# EAGLE schematic minion1 (EAGLE 7.7.0)
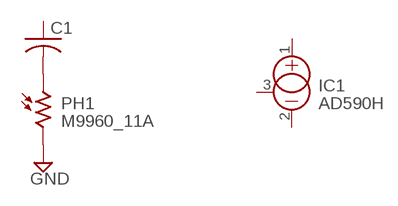
[diagram p0: schematic, sheet 1]

## Parts
C1  C-US025-024X044  [C025-024X044]
IC1  AD590H  [TO18]
PH1  M9960_11A  [M9960]

## Nets
GND: PH1.2
N$1: C1.2 PH1.1
Unconnected: C1.1 IC1.1(+) IC1.2(-) IC1.3(CAN)

## Library data of the parts
C1 = rcl:C-US: CAPACITOR, American symbol
IC1 = linear:AD590H: TEMPERATURE SENSOR current output
PH1 = photo-elements:M9960_11: Photo Sensor Beacon Light, Photometer Applications Source: http://optoelectronics.perkinelmer.com/content/Datasheets/DTS_M9960.pdf